# EasyEDA Pro project USB_FLARM_UPDATER_pre-layout-20260308-223306.eprj

# Schematic Schematic1
Board Name: Board1; Create Date: 2026-02-26; Page Name: P1; Project Name: USB_FLARM_UPDATER; Schematic Name: Schematic1; Update Date: 2026-02-27; Company: EasyEDA.com; Page Size: A4; Version: V1.0
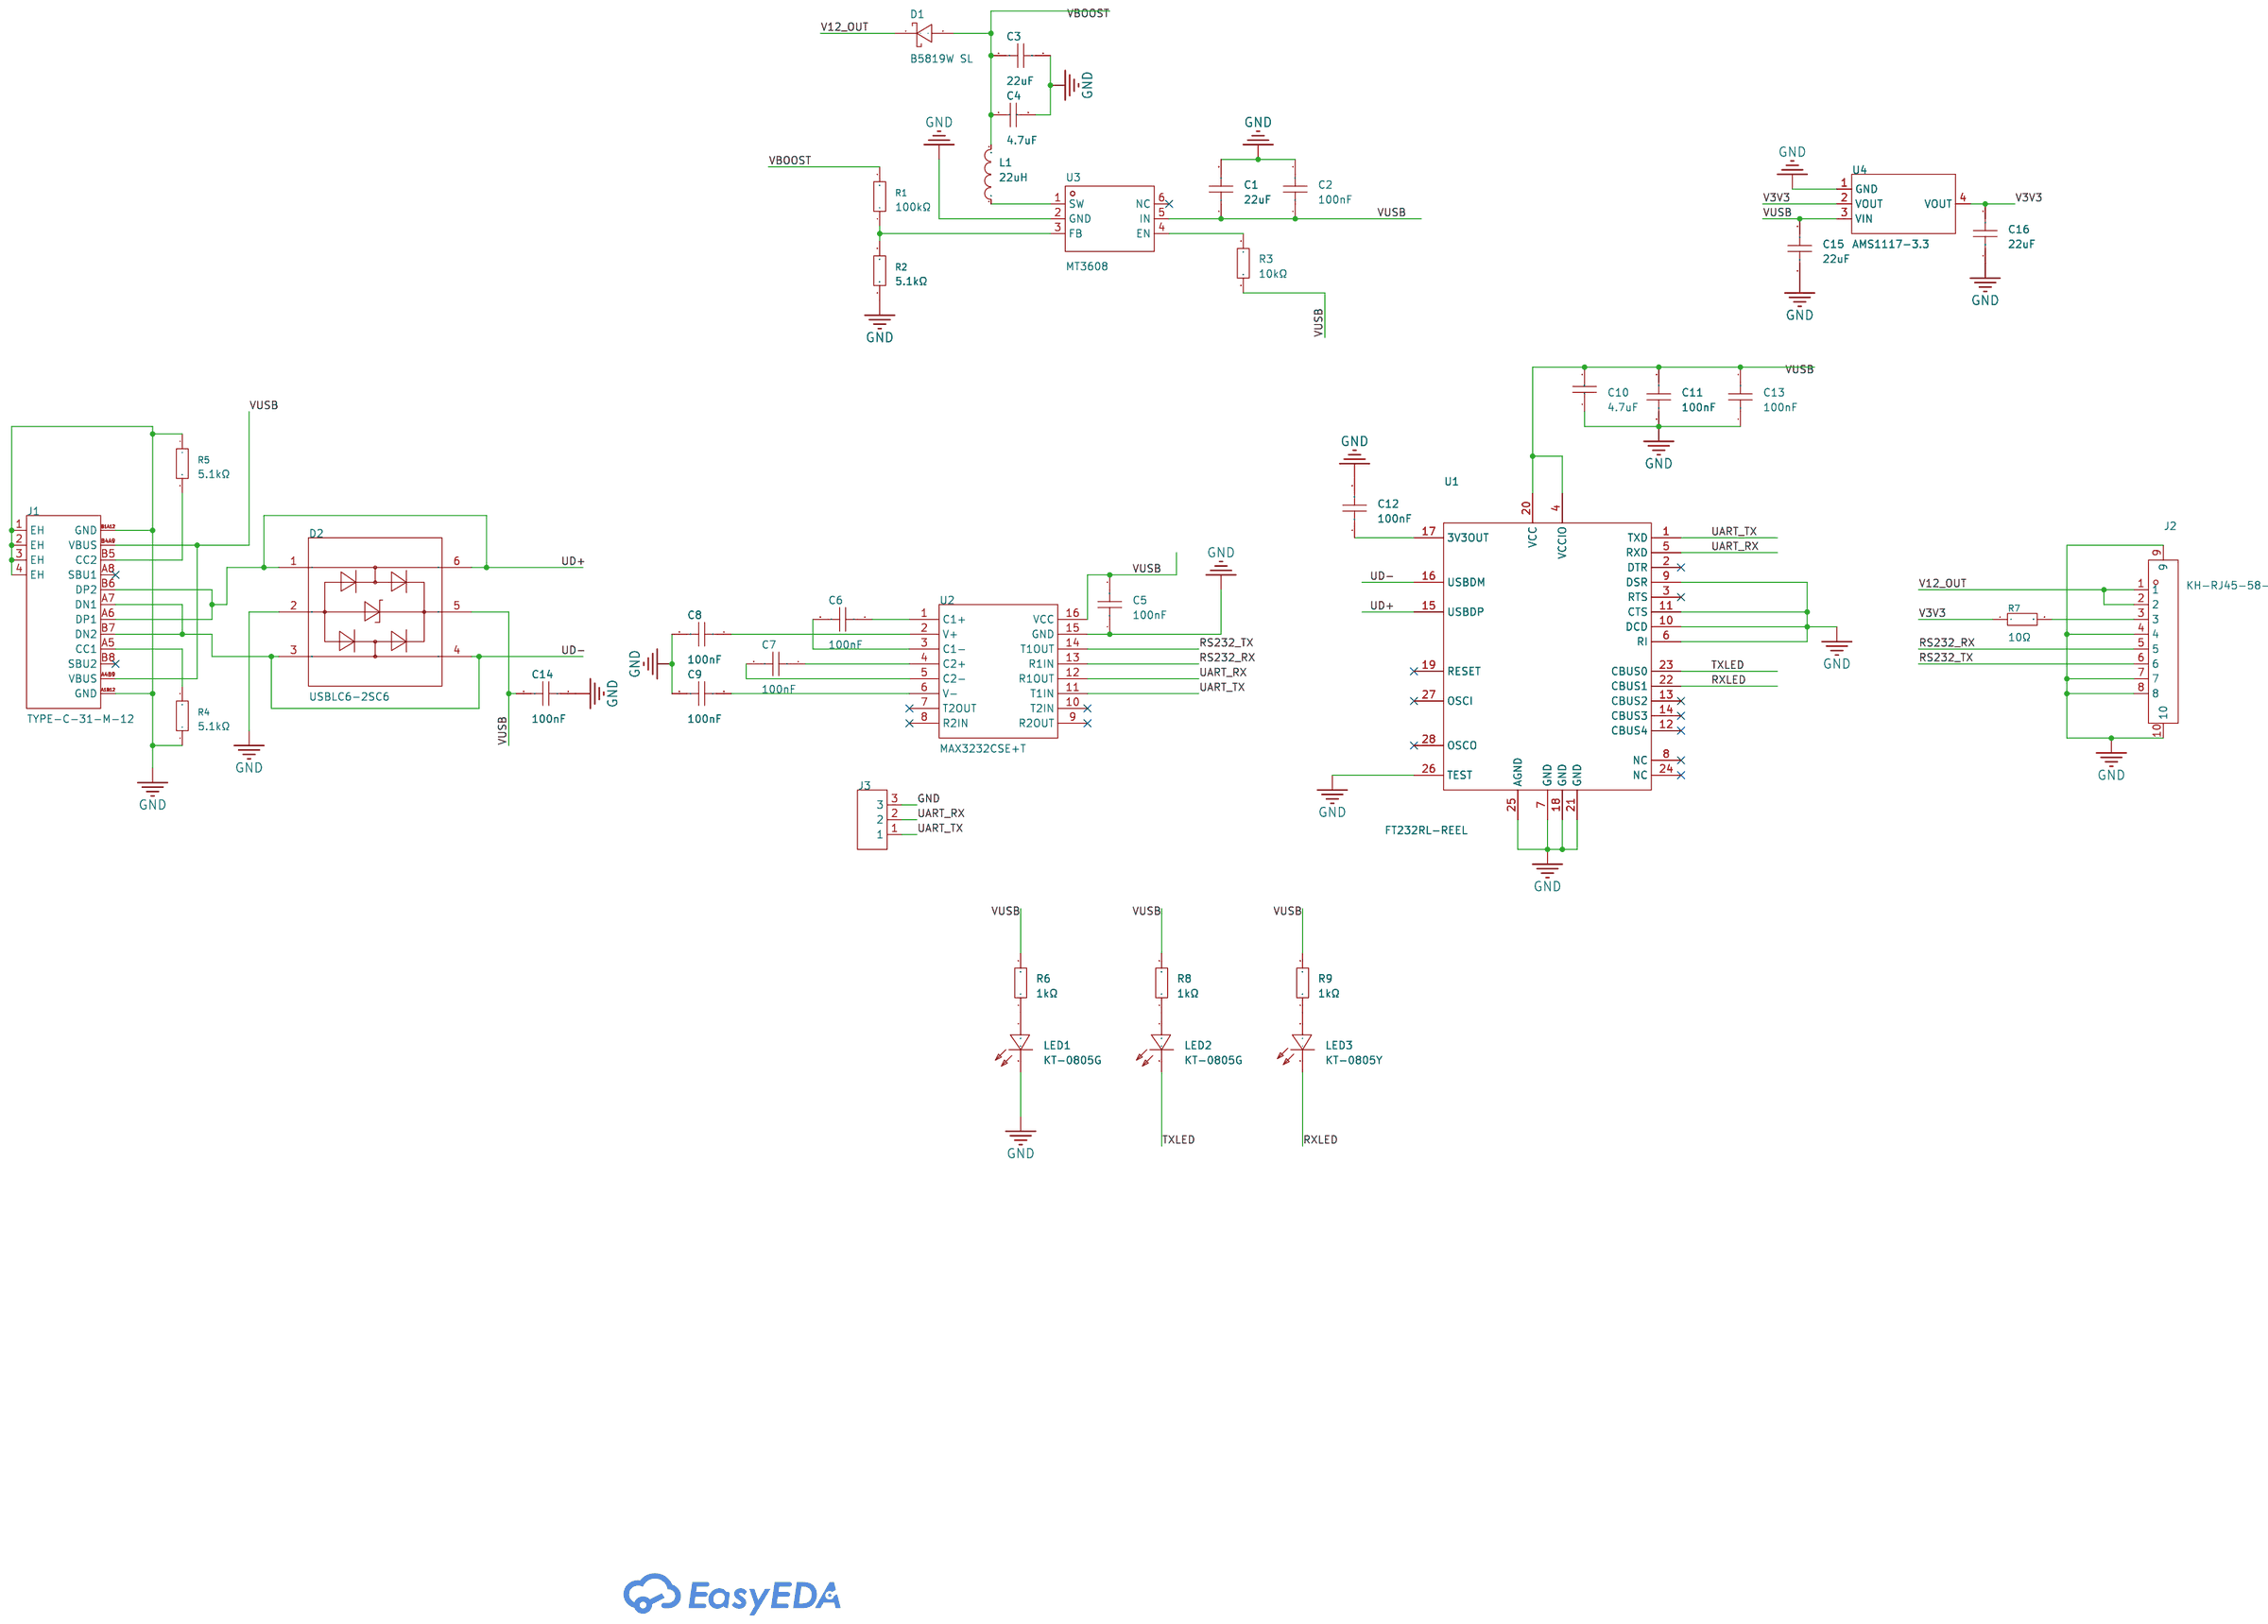
[diagram p0: schematic sheet]

## Parts
C1  22uF  [C0805]
C2  100nF  [C0402]
C3  22uF  [C0805]
C4  4.7uF  [C0805]
C5  100nF  [C0402]
C6  100nF  [C0402]
C7  100nF  [C0402]
C8  100nF  [C0402]
C9  100nF  [C0402]
C10  4.7uF  [C0805]
C11  100nF  [C0402]
C12  100nF  [C0402]
C13  100nF  [C0402]
C14  100nF  [C0402]
C15  22uF  [C0805]
C16  22uF  [C0805]
D1  B5819W SL  [SOD-123_L2.7-W1.6-LS3.7-RD-1]
D2  USBLC6-2SC6  [SOT-23-6_L2.9-W1.6-P0.95-LS2.8-BL]
J1  TYPE-C-31-M-12  [USB-C_SMD-TYPE-C-31-M-12_1]
J2  KH-RJ45-58-8P8C  [RJ45-TH_KH-RJ45-58-8P8C]
J3  -  [HDR-TH_3P-P2.54-V-M]
L1  22uH  [IND-SMD_L4.0-W4.0_LQH44PN2R2MP0L]
LED1  KT-0805G  [LED0805-R-RD]
LED2  KT-0805G  [LED0805-R-RD]
LED3  KT-0805Y  [LED0805-R-RD]
R1  100kΩ  [R0402]
R2  5.1kΩ  [R0402]
R3  10kΩ  [R0402]
R4  5.1kΩ  [R0402]
R5  5.1kΩ  [R0402]
R6  1kΩ  [R0402]
R7  10Ω  [R0402]
R8  1kΩ  [R0402]
R9  1kΩ  [R0402]
U1  FT232RL-REEL  [SSOP-28_L10.2-W5.3-P0.65-LS7.8-BL]
U2  MAX3232CSE+T  [SOIC-16_L9.9-W3.9-P1.27-LS6.0-BL]
U3  MT3608  [SOT-23-6_L2.9-W1.6-P0.95-LS2.8-BL]
U4  AMS1117-3.3  [SOT-223-3_L6.5-W3.4-P2.30-LS7.0-BR]

## Library data of the parts
C1 C3 C15 C16 = CL21A226MAQNNNE: LCSC Part Name: 22uF ±20% 25V; Supplier Part: C45783; Manufacturer: SAMSUNG(三星); Supplier Footprint: 0805; JLCPCB Part Class: Basic Part; Datasheet: https://item.szlcsc.com/datasheet/CL21A226MAQNNNE/46786.html; Supplier: LCSC; Tolerance: ±20%; Voltage Rating: 25V; Temperature Coefficient: X5R
C2 C5-C9 C11-C14 = CL05B104KB54PNC: LCSC Part Name: 100nF ±10% 50V; Supplier Part: C307331; Manufacturer: SAMSUNG(三星); Supplier Footprint: 0402; JLCPCB Part Class: Basic Part; Datasheet: https://item.szlcsc.com/datasheet/CL05B104KB54PNC/291005.html; Supplier: LCSC; Tolerance: ±10%; Voltage Rating: 50V; Temperature Coefficient: X7R
C4 C10 = CL21A475KAQNNNE: LCSC Part Name: 4.7uF ±10% 25V; Supplier Part: C1779; Manufacturer: SAMSUNG(三星); Supplier Footprint: 0805; JLCPCB Part Class: Basic Part; Datasheet: https://item.szlcsc.com/datasheet/CL21A475KAQNNNE/2131.html; Supplier: LCSC; Tolerance: ±10%; Voltage Rating: 25V; Temperature Coefficient: X5R
D1 = B5819W SL: LCSC Part Name: 电压:40V 电流:1A; Supplier Part: C8598; Manufacturer: CJ(江苏长电/长晶); Supplier Footprint: SOD-123; JLCPCB Part Class: Basic Part; Datasheet: https://item.szlcsc.com/datasheet/B5819W%2520SL/9093.html; Supplier: LCSC; Voltage - Forward(Vf@If): 600mV@1A; Voltage - DC Reverse(Vr): 40V; Current - Rectified: 1A; Non-Repetitive Peak Forward Surge Current: 9A
D2 = USBLC6-2SC6_C7519: LCSC Part Name: 单向ESD; Supplier Part: C7519; Manufacturer: ST(意法半导体); Supplier Footprint: SOT-23-6L; JLCPCB Part Class: Extended Part; Datasheet: https://item.szlcsc.com/datasheet/USBLC6-2SC6/7996.html; Supplier: LCSC; Polarity: Unidirectional; Reverse Stand-Off Voltage (Vrwm): 5.25V; Clamping Voltage: 17V; Peak Pulse Current (Ipp): 5A; Voltage - Breakdown: 6V; Reverse Leakage Current (Ir): 150nA; Number of Channels: 2; Operating Temperature: -40℃~+125℃; level of protection: IEC 61000-4-2; Type: ESD; Junction Capacitance: 3.5pF
J1 = TYPE-C-31-M-12: LCSC Part Name: Type-C 母 卧贴; Supplier Part: C165948; Manufacturer: 韩国韩荣; Supplier Footprint: SMD; JLCPCB Part Class: Extended Part; Datasheet: https://item.szlcsc.com/datasheet/TYPE-C-31-M-12/177331.html; Supplier: LCSC; Connector Type: Type-C; Gender: Female; Mounting Type: Surface Mount, Right Angle; Number of Contacts: 16P; Number of Ports: 1; Current Rating-Power: 5A; Voltage Rating: 20V; Connect-Disconnect Life: 10,000 cycles; Length: 7.35mm; Operating Temperature: -30℃~+80℃
J2 = KH-RJ45-58-8P8C: LCSC Part Name: 弯插 不带LED; Supplier Part: C2683360; Manufacturer: kinghelm(金航标); Supplier Footprint: 弯插; JLCPCB Part Class: Extended Part; Datasheet: https://item.szlcsc.com/datasheet/KH-RJ45-58-8P8C/2779581.html; Supplier: LCSC; Connector Type: RJ45 Jack; Mounting Type: Right Angle; Number of Ports: 1; LED: Non-LED; Shielding: Shielded; PoE: Non-PoE; Contact Material: Phosphor Bronze; Contact Plating: Gold; Operating Temperature: -25℃~+70℃
J3 = HDR-M_2.54_1x3P: Supplier Footprint: Through
L1 = SMNR4020-22UH: LCSC Part Name: 22uH ±20% 1.05A; Supplier Part: C135264; Manufacturer: SXN(顺翔诺); Supplier Footprint: SMD,4x4mm; JLCPCB Part Class: Extended Part; Datasheet: https://item.szlcsc.com/datasheet/SMNR4020-22UH/146575.html; Supplier: LCSC; Tolerance: ±20%; Current Rating: 1.05A; Current - Saturation(Isat): 1.05A; DC Resistance(DCR): 455mΩ; Type: Magnetic Shielded Inductor
LED1 LED2 = KT-0805G: LCSC Part Name: 0805 翠绿 高亮; Supplier Part: C2297; Manufacturer: KENTO; Supplier Footprint: 0805; JLCPCB Part Class: Basic Part; Datasheet: https://item.szlcsc.com/datasheet/KT-0805G/2670.html; Supplier: LCSC; Illumination Color: Emerald Green; Voltage - Forward(Vf): 2.6V~3.1V; Power(Watts): 100mW; Forward Current: 5mA; Wavelength - Dominant: 513nm~528nm; Peak Wavelength: 525nm; Luminous Intensity: 430mcd; Viewing Angle: 120°; Operating Temperature: -40℃~+85℃
LED3 = KT-0805Y: LCSC Part Name: 0805 黄灯 高亮; Supplier Part: C2296; Manufacturer: KENTO; Supplier Footprint: 0805; JLCPCB Part Class: Basic Part; Datasheet: https://item.szlcsc.com/datasheet/KT-0805Y/2669.html; Supplier: LCSC; Illumination Color: Yellow; Voltage - Forward(Vf): 1.8V~2.4V; Power(Watts): 40mW; Wavelength - Dominant: 584nm~594nm; Peak Wavelength: 596nm; Lens Color: Water Clear; Luminous Intensity: 175mcd; Viewing Angle: 120°; Operating Temperature: -40℃~+85℃
R1 = 0402WGF1003TCE: LCSC Part Name: 100kΩ ±1% 62.5mW 厚膜电阻; Supplier Part: C25741; Manufacturer: UNI-ROYAL(厚声); Supplier Footprint: 0402; JLCPCB Part Class: Basic Part; Datasheet: https://item.szlcsc.com/datasheet/0402WGF1003TCE/26484.html; Supplier: LCSC; Type: Thick Film Resistor; Tolerance: ±1%; Power(Watts): 62.5mW; Voltage-Supply(Max): 50V; Temperature Coefficient: ±100ppm/℃; Operating Temperature: -55℃~+155℃
R2 R4 R5 = 0402WGF5101TCE: LCSC Part Name: 5.1kΩ ±1% 62.5mW 厚膜电阻; Supplier Part: C25905; Manufacturer: UNI-ROYAL(厚声); Supplier Footprint: 0402; JLCPCB Part Class: Basic Part; Datasheet: https://item.szlcsc.com/datasheet/0402WGF5101TCE/26648.html; Supplier: LCSC; Type: Thick Film Resistor; Tolerance: ±1%; Power(Watts): 62.5mW; Voltage-Supply(Max): 50V; Temperature Coefficient: ±100ppm/℃; Operating Temperature: -55℃~+155℃
R3 = 0402WGF1002TCE: LCSC Part Name: 10kΩ ±1% 62.5mW 厚膜电阻; Supplier Part: C25744; Manufacturer: UNI-ROYAL(厚声); Supplier Footprint: 0402; JLCPCB Part Class: Basic Part; Datasheet: https://item.szlcsc.com/datasheet/0402WGF1002TCE/26487.html; Supplier: LCSC; Type: Thick Film Resistor; Tolerance: ±1%; Power(Watts): 62.5mW; Voltage-Supply(Max): 50V; Temperature Coefficient: ±100ppm/℃; Operating Temperature: -55℃~+155℃
R6 R8 R9 = 0402WGF1001TCE: LCSC Part Name: 1kΩ ±1% 62.5mW 厚膜电阻; Supplier Part: C11702; Manufacturer: UNI-ROYAL(厚声); Supplier Footprint: 0402; JLCPCB Part Class: Basic Part; Datasheet: https://item.szlcsc.com/datasheet/0402WGF1001TCE/12256.html; Supplier: LCSC; Type: Thick Film Resistor; Tolerance: ±1%; Power(Watts): 62.5mW; Voltage-Supply(Max): 50V; Temperature Coefficient: ±100ppm/℃; Operating Temperature: -55℃~+155℃
R7 = 0402WGF100JTCE: LCSC Part Name: 10Ω ±1% 62.5mW 厚膜电阻; Supplier Part: C25077; Manufacturer: UNI-ROYAL(厚声); Supplier Footprint: 0402; JLCPCB Part Class: Basic Part; Datasheet: https://item.szlcsc.com/datasheet/0402WGF100JTCE/25820.html; Supplier: LCSC; Type: Thick Film Resistor; Tolerance: ±1%; Power(Watts): 62.5mW; Voltage-Supply(Max): 50V; Temperature Coefficient: ±200ppm/℃; Operating Temperature: -55℃~+155℃
U1 = FT232RL-REEL: LCSC Part Name: FT232R USB UART 芯片; Supplier Part: C8690; Manufacturer: FTDI(飞特帝亚); Supplier Footprint: SSOP-28-208mil; JLCPCB Part Class: Extended Part; Datasheet: https://item.szlcsc.com/datasheet/FT232RL-REEL/9194.html; Supplier: LCSC; Applications Function: USB to UART; USB Protocol: USB 2.0; Voltage - Supply: 3.3V~5.25V; Data Rate: 3Mbps; Operating Temperature: -40℃~+85℃; Current - Supply: 15mA; Supply Current (Iq): 70uA
U2 = MAX3232CSE+T_C7258: LCSC Part Name: 3.0V至5.5V，低功耗，最高1Mbps，真正的RS-232收发器，使用四个0.1μF外部电容; Supplier Part: C7258; Manufacturer: ADI(亚德诺)/MAXIM(美信); Supplier Footprint: SOIC-16; JLCPCB Part Class: Extended Part; Datasheet: https://item.szlcsc.com/datasheet/MAX3232CSE%252BT/7735.html; Supplier: LCSC; Type: transceiver; Number of Drivers: 2; Number of Receivers: 2; Data Rate: 235Kbps; Voltage - Supply: 3V~5.5V; Operating Temperature: 0℃~+70℃
U3 = MT3608: LCSC Part Name: 老版本 高效1.2MHz 2A升压转换器; Supplier Part: C84817; Manufacturer: 西安航天民芯; Supplier Footprint: SOT-23-6; JLCPCB Part Class: Extended Part; Datasheet: https://item.szlcsc.com/datasheet/MT3608/85988.html; Supplier: LCSC; Function: Boost; Output Type: Adjustable; Voltage - Supply: 2V~24V; Output Current: 2A; Frequency - Switching: 1.2MHz; Operating Temperature: -40℃~+85℃; Synchronous Rectifier: No; Number of Outputs: 1; Topology: Boost; Quiescent Current: 100uA；1.6mA; Switch tube (built-in/external): Built-in
U4 = AMS1117-3.3_C6186: LCSC Part Name: 输出3.3V 1A; Supplier Part: C6186; Manufacturer: AMS; Supplier Footprint: SOT-223; JLCPCB Part Class: Basic Part; Datasheet: https://item.szlcsc.com/datasheet/AMS1117-3.3/6652.html; Supplier: LCSC; Output Type: Fixed; Voltage - Supply: 16V; Output Voltage: 3.3V; Output Current: 1A; Power Supply Rejection Ratio (PSRR): 72dB@(120Hz); Voltage Dropout: 1.1V@(800mA); standby current: 5mA; Noise: 0.003%Vout; Features: Over Current Protection；Over Temperature Protection; Operating Temperature: -40℃~+125℃; Output Configuration: Positive; Number of Outputs: 1

## Nets
GND: C1.2 C2.2 C3.2 C4.2 C5.1 C8.2 C9.2 C10.1 C11.1 C12.2 C13.1 C14.2 C15.1 C16.1 D2.2 J1.1(EH) J1.2(EH) J1.3(EH) J1.4(EH) J1.A1B12(GND) J1.B1A12(GND) J2.4 J2.7 J2.8 J2.9 J2.10 J3.3 LED1.2(K) R2.1 R4.1 R5.1 U1.6(RI) U1.7(GND) U1.9(DSR) U1.10(DCD) U1.11(CTS) U1.18(GND) U1.21(GND) U1.25(AGND) U1.26(TEST) U2.15(GND) U3.2(GND) U4.1(GND)
V3V3: C16.2 R7.1 U4.2(VOUT) U4.4(VOUT)
V12_OUT: D1.1(-) J2.1 J2.2
RS232_RX: J2.5 U2.13(R1IN)
RS232_TX: J2.6 U2.14(T1OUT)
RXLED: LED3.2(-) U1.22(CBUS1)
TXLED: LED2.2(K) U1.23(CBUS0)
UART_RX: J3.2 U1.5(RXD) U2.12(R1OUT)
UART_TX: J3.1 U1.1(TXD) U2.11(T1IN)
UD+: D2.1 D2.6 J1.A6(DP1) J1.B6(DP2) U1.15(USBDP)
UD-: D2.3 D2.4 J1.A7(DN1) J1.B7(DN2) U1.16(USBDM)
VBOOST: C3.1 C4.1 D1.2(+) L1.2 R1.2
VUSB: C1.1 C2.1 C5.2 C10.2 C11.2 C13.2 C14.1 C15.2 D2.5 J1.A4B9(VBUS) J1.B4A9(VBUS) R3.2 R6.2 R8.2 R9.2 U1.4(VCCIO) U1.20(VCC) U2.16(VCC) U3.5(IN) U4.3(VIN)
$1N2847: R3.1 U3.4(EN)
$1N2860: L1.1 U3.1(SW)
$1N2875: R1.1 R2.2 U3.3(FB)
$1N3104: C6.1 U2.1(C1+)
$1N3108: C6.2 U2.3(C1-)
$1N3114: C7.1 U2.4(C2+)
$1N3119: C7.2 U2.5(C2-)
$1N3125: C8.1 U2.2(V+)
$1N3129: C9.1 U2.6(V-)
$1N3345: C12.1 U1.17(3V3OUT)
$1N3570: J2.3 R7.2
$1N3909: J1.A5(CC1) R4.2
$1N3913: J1.B5(CC2) R5.2
$1N4089: LED1.1(A) R6.1
$1N4091: LED2.1(A) R8.1
$1N4093: LED3.1(+) R9.1

Not connected (* = marked no-connect by the designer): J1 A8(SBU1)* B8(SBU2)*; U1 2(DTR)* 3(RTS)* 8(NC)* 12(CBUS4)* 13(CBUS2)* 14(CBUS3)* 19(RESET)* 24(NC)* 27(OSCI)* 28(OSCO)*; U2 7(T2OUT)* 8(R2IN)* 9(R2OUT)* 10(T2IN)*; U3 6(NC)*

# Board PCB1
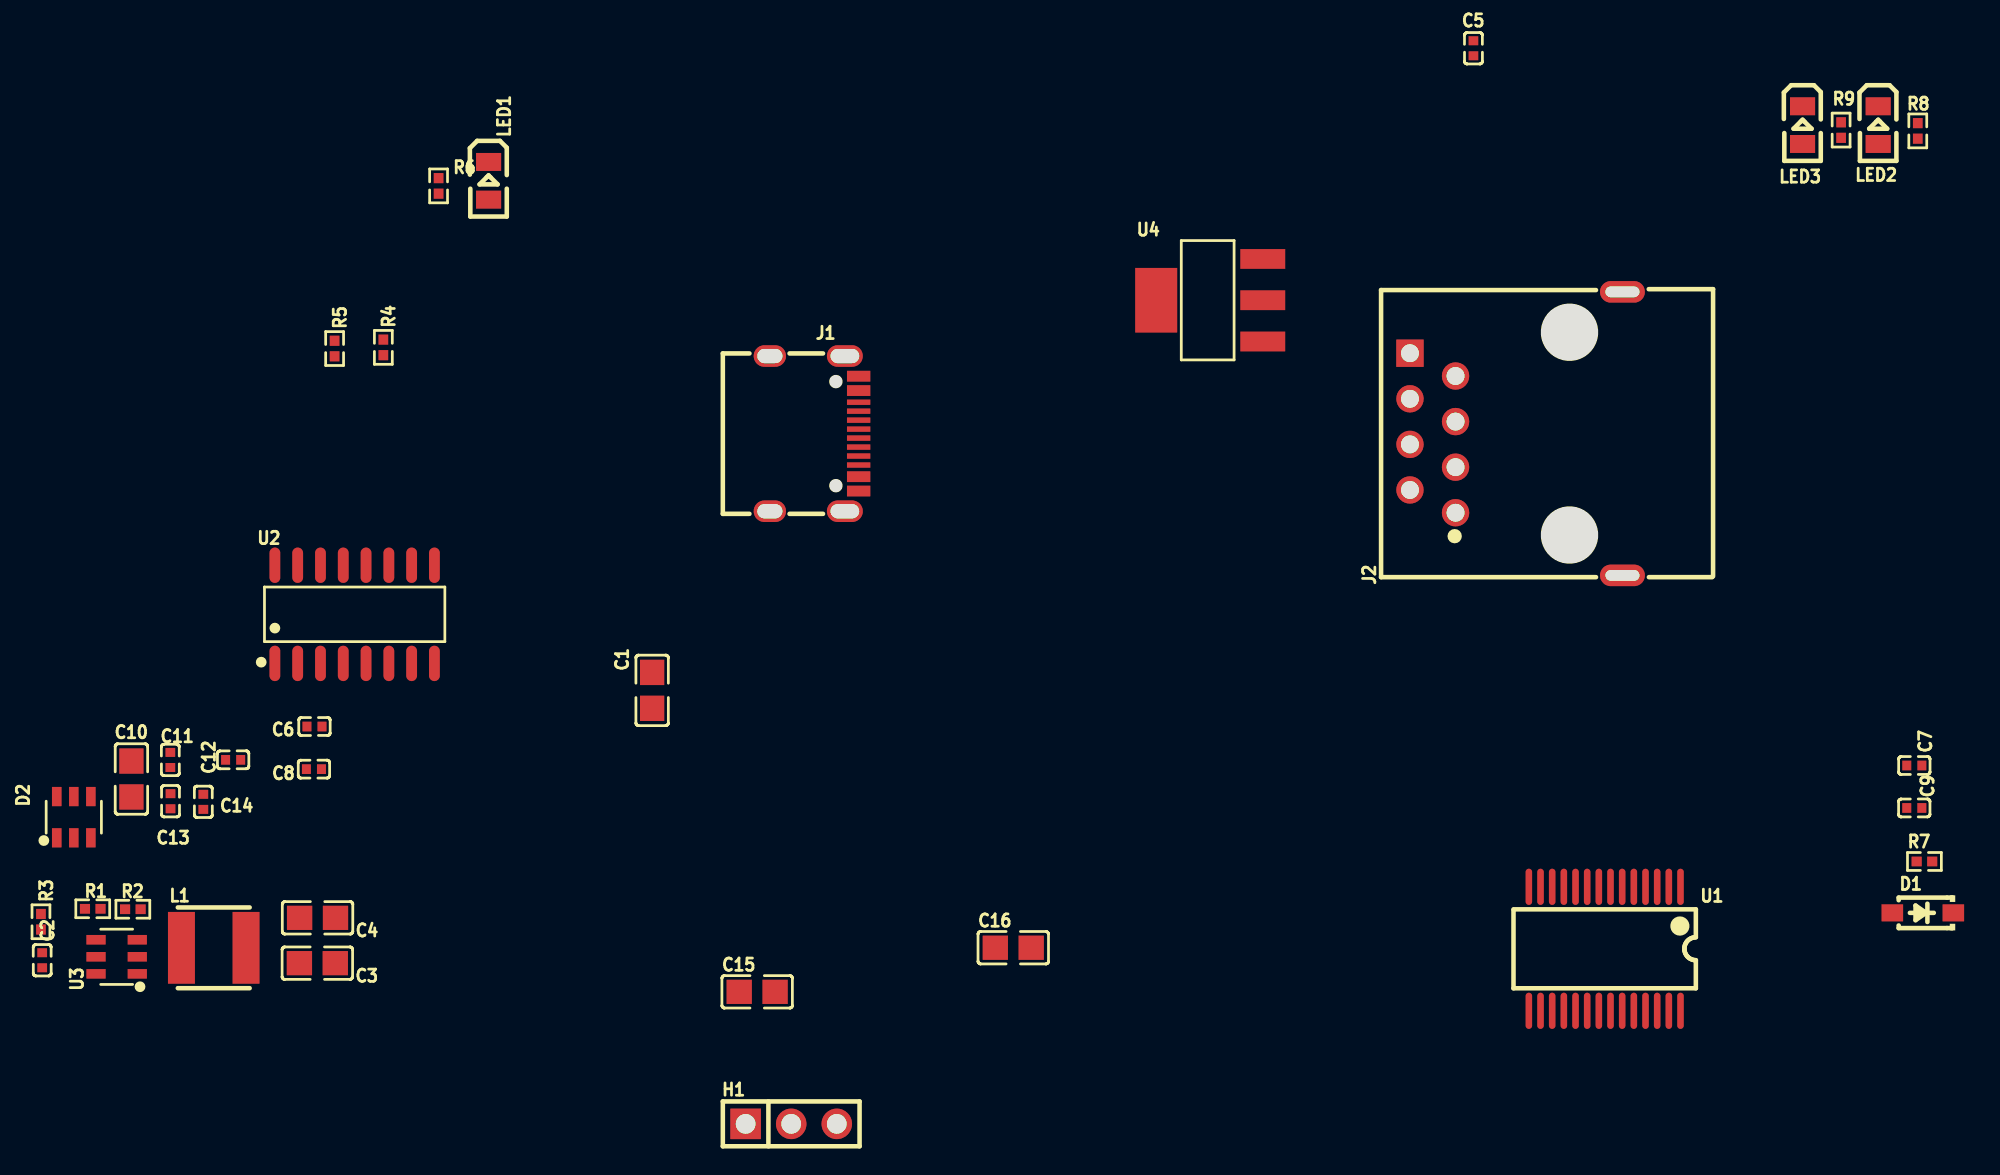
[diagram p1: board, top side]
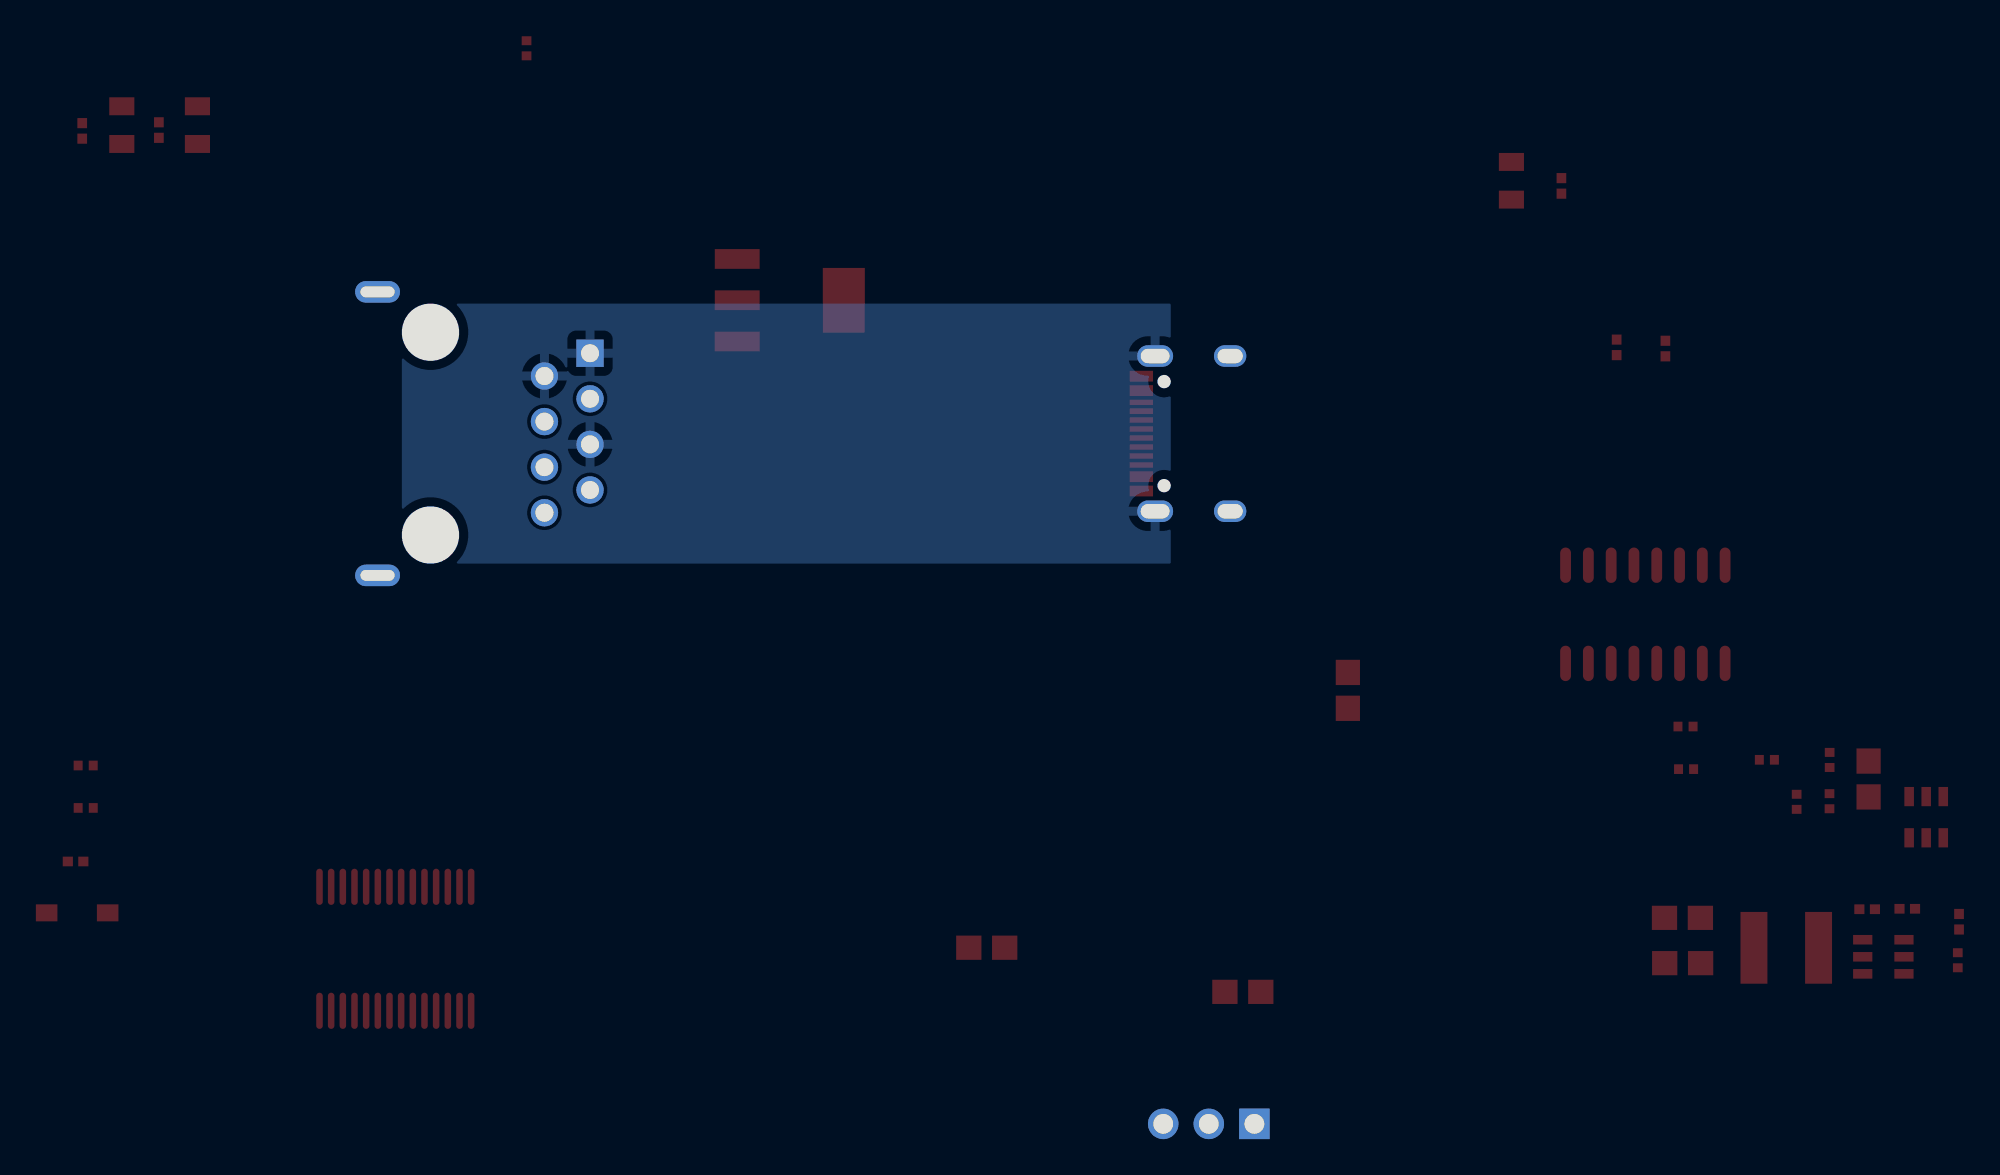
[diagram p2: board, bottom side, seen from below]

Outline 42.85 x 14.49 mm; copper layers: Top Layer, Bottom Layer. Coordinates in mm from the lower left corner of the outline.
Stack: Top Layer 0.035mm / Dielectric1 1.51mm FR4 er 4.5 / Bottom Layer 0.035mm

## Design rules (mm)
net VUSB: Power
net VBOOST: Power
net V12_OUT: Power_12V
net UD+: DP1
net UD-: DP1
net $1N2860: Power
template: Custom Config
spacing copperThickness1oz (default): track to track 0.102, other pairs 0.152 to 0.5
spacing copperThickness2oz: track to track 0.203, other pairs 0.152 to 0.3
track width copperThickness1oz (default): min 0.127, default 0.254, max 2.54
track width copperThickness2oz: min 0.203, default 0.254, max 2.54
track width 20mil: min 0.127, default 0.508, max 2.54
track width 15mil: min 0.127, default 0.254, max 0.381
differential pair differentialPair (default): width min 0.127, default 0.254, max 2.54; gap min 0.152, default 0.152
via viaSize (default): diameter min 0.5, default 0.61, max 10; hole min 0.3, default 0.305, max 6.3
net class Power uses 20mil
net class Power_12V uses 15mil
net VUSB uses 20mil
net VBOOST uses 20mil
net V12_OUT uses 15mil
net $1N2860 uses 20mil

## Placement (name value [footprint] x y rotation side)
C1  22uF  [C0805]  -9.87 -7.06 270 top
C2  100nF  [C0402]  -43.85 -22.11 270 top
C3  22uF  [C0805]  -28.52 -22.27 180 top
C4  4.7uF  [C0805]  -28.51 -19.74 180 top
C5  100nF  [C0402]  35.9 28.72 90 top
C6  100nF  [C0402]  -28.68 -9.08 0 top
C7  100nF  [C0402]  60.47 -11.25 0 top
C8  100nF  [C0402]  -28.71 -11.45 180 top
C9  100nF  [C0402]  60.46 -13.62 180 top
C10  4.7uF  [C0805]  -38.88 -12 90 top
C11  100nF  [C0402]  -36.71 -10.94 90 top
C12  100nF  [C0402]  -33.22 -10.93 0 top
C13  100nF  [C0402]  -36.71 -13.24 90 top
C14  100nF  [C0402]  -34.88 -13.28 270 top
C15  22uF  [C0805]  -4.02 -23.87 0 top
C16  22uF  [C0805]  10.26 -21.41 0 top
D1  B5819W SL  [SOD-123_L2.7-W1.6-LS3.7-RD-1]  60.94 -19.46 180 top
D2  USBLC6-2SC6  [SOT-23-6_L2.9-W1.6-P0.95-LS2.8-BL]  -42.09 -14.13 0 top
H1  -  [HDR-TH_3P-P2.54-V-M]  -2.12 -31.22 0 top
J1  TYPE-C-31-M-12  [USB-C_SMD-TYPE-C-31-M-12_1]  -0.83 7.25 270 top
J2  KH-RJ45-58-8P8C  [RJ45-TH_KH-RJ45-58-8P8C]  38.28 7.25 90 top
L1  22uH  [IND-SMD_L4.0-W4.0_LQH44PN2R2MP0L]  -34.3 -21.41 0 top
LED1  KT-0805G  [LED0805-R-RD]  -18.98 21.34 270 top
LED2  KT-0805G  [LED0805-R-RD]  58.45 24.44 270 top
LED3  KT-0805Y  [LED0805-R-RD]  54.24 24.44 270 top
R1  100kΩ  [R0402]  -41.04 -19.24 0 top
R2  5.1kΩ  [R0402]  -38.8 -19.26 180 top
R3  10kΩ  [R0402]  -43.92 -19.96 270 top
R4  5.1kΩ  [R0402]  -24.84 12.05 270 top
R5  5.1kΩ  [R0402]  -27.56 11.99 270 top
R6  1kΩ  [R0402]  -21.77 21.05 270 top
R7  10Ω  [R0402]  61.03 -16.6 0 top
R8  1kΩ  [R0402]  60.66 24.12 90 top
R9  1kΩ  [R0402]  56.39 24.16 90 top
U1  FT232RL-REEL  [SSOP-28_L10.2-W5.3-P0.65-LS7.8-BL]  43.21 -21.47 180 top
U2  MAX3232CSE+T  [SOIC-16_L9.9-W3.9-P1.27-LS6.0-BL]  -26.44 -2.82 0 top
U3  MT3608  [SOT-23-6_L2.9-W1.6-P0.95-LS2.8-BL]  -39.71 -21.91 90 top
U4  AMS1117-3.3  [SOT-223-3_L6.5-W3.4-P2.30-LS7.0-BR]  21.19 14.68 0 top

## Footprints (pads in the part's own frame, mm; a bottom-side part is the same pattern mirrored in y, then rotated)
C0402
  rect 0.5x0.54 smd: 1(-0.42,0) 2(0.42,0)
C0805
  rect 1.41x1.35 smd: 1(-1,0) 2(1,0)
HDR-TH_3P-P2.54-V-M
  rect 1.7x1.7 hole 1.1: 1(-2.54,0)
  round 1.7 hole 1.1: 2(0,0) 3(2.54,0)
IND-SMD_L4.0-W4.0_LQH44PN2R2MP0L
  rect 1.5x4 smd: 1(-1.8,0) 2(1.8,0)
LED0805-R-RD
  rect 1x1.399 smd: 1(1.05,0) 2(-1.05,0)
R0402
  rect 0.566x0.54 smd: 1(-0.433,0) 2(0.433,0)
RJ45-TH_KH-RJ45-58-8P8C
  round 1.524 hole 1: 1(-4.41,3.38) 2(-3.139,5.92) 3(-1.869,3.38) 4(-0.6,5.92) 5(0.67,3.38) 6(1.94,5.92) 7(3.211,3.38)
  rect 1.524x1.524 hole 1: 8(4.481,5.92)
  oval 1.2x2.5 hole 0.6x1.9: 9(-7.9,-5.92) 10(7.9,-5.92)
SOD-123_L2.7-W1.6-LS3.7-RD-1
  rect 1.2x0.95 smd: 1(-1.7,0) 2(1.7,0)
SOIC-16_L9.9-W3.9-P1.27-LS6.0-BL
  oval 0.602x1.971 smd: 1(-4.445,-2.736) 2(-3.175,-2.736) 3(-1.905,-2.736) 4(-0.635,-2.736) 5(0.635,-2.736) 6(1.905,-2.736) 7(3.175,-2.736) 8(4.445,-2.736) 9(4.445,2.736) 10(3.175,2.736) 11(1.905,2.736) 12(0.635,2.736) 13(-0.635,2.736) 14(-1.905,2.736) 15(-3.175,2.736) 16(-4.445,2.736)
SOT-23-6_L2.9-W1.6-P0.95-LS2.8-BL
  rect 0.532x1.072 smd: 1(-0.95,-1.149) 2(0,-1.149) 3(0.95,-1.149) 4(0.95,1.149) 5(0,1.149) 6(-0.95,1.149)
SOT-223-3_L6.5-W3.4-P2.30-LS7.0-BR
  rect 2.5x1.1 smd: 1(2.97,-2.3) 2(2.97,0) 3(2.97,2.3)
  rect 2.34x3.6 smd: 4(-2.97,0)
SSOP-28_L10.2-W5.3-P0.65-LS7.8-BL
  oval 0.364x2.015 smd: 1(-4.225,-3.455) 2(-3.575,-3.455) 3(-2.925,-3.455) 4(-2.275,-3.455) 5(-1.625,-3.455) 6(-0.975,-3.455) 7(-0.325,-3.455) 8(0.325,-3.455) 9(0.975,-3.455) 10(1.625,-3.455) 11(2.275,-3.455) 12(2.925,-3.455) 13(3.575,-3.455) 14(4.225,-3.455) 15(4.225,3.455) 16(3.575,3.455) 17(2.925,3.455) 18(2.275,3.455) 19(1.625,3.455) 20(0.975,3.455) 21(0.325,3.455) 22(-0.325,3.455) 23(-0.975,3.455) 24(-1.625,3.455) 25(-2.275,3.455) 26(-2.925,3.455) 27(-3.575,3.455) 28(-4.225,3.455)
USB-C_SMD-TYPE-C-31-M-12_1
  oval 1.2x2 hole 0.8x1.6: 1(4.325,1.706) 4(-4.325,1.706)
  oval 1.2x1.8 hole 0.8x1.4: 2(4.325,-2.474) 3(-4.325,-2.474)
  custom 0.6x1.3 smd: A1B12(-3.2,2.474) A4B9(-2.4,2.474) B1A12(3.2,2.474) B4A9(2.401,2.474)
  rect 0.3x1.3 smd: A5(-1.25,2.474) A6(-0.25,2.474) A7(0.25,2.474) A8(1.25,2.474) B5(1.75,2.474) B6(0.75,2.474) B7(-0.75,2.474) B8(-1.75,2.474)

## Nets
As in the schematic, except:
GND: C1.2 C2.2 C3.2 C4.2 C5.1 C8.2 C9.2 C10.1 C11.1 C12.2 C13.1 C14.2 C15.1 C16.1 D2.2 H1.3 J1.1 J1.2 J1.3 J1.4 J1.A1B12 J1.B1A12 J2.4 J2.7 J2.8 J2.9 J2.10 LED1.2 R2.1 R4.1 R5.1 U1.6 U1.7 U1.9 U1.10 U1.11 U1.18 U1.21 U1.25 U1.26 U2.15 U3.2 U4.1
UART_RX: H1.2 U1.5 U2.12
UART_TX: H1.1 U1.1 U2.11

Pads without a net: J1 A8 B8; U1 2 3 8 12 13 14 19 24 27 28; U2 7 8 9 10; U3 6

## Copper pours and planes (outline as drawn; the poured copper is in the pictures)
GND on Bottom Layer: -5.35,22.52 45.89,22.52 45.89,-7.9 -5.35,-7.9
